# EAGLE schematic main (EAGLE 8.7.0)
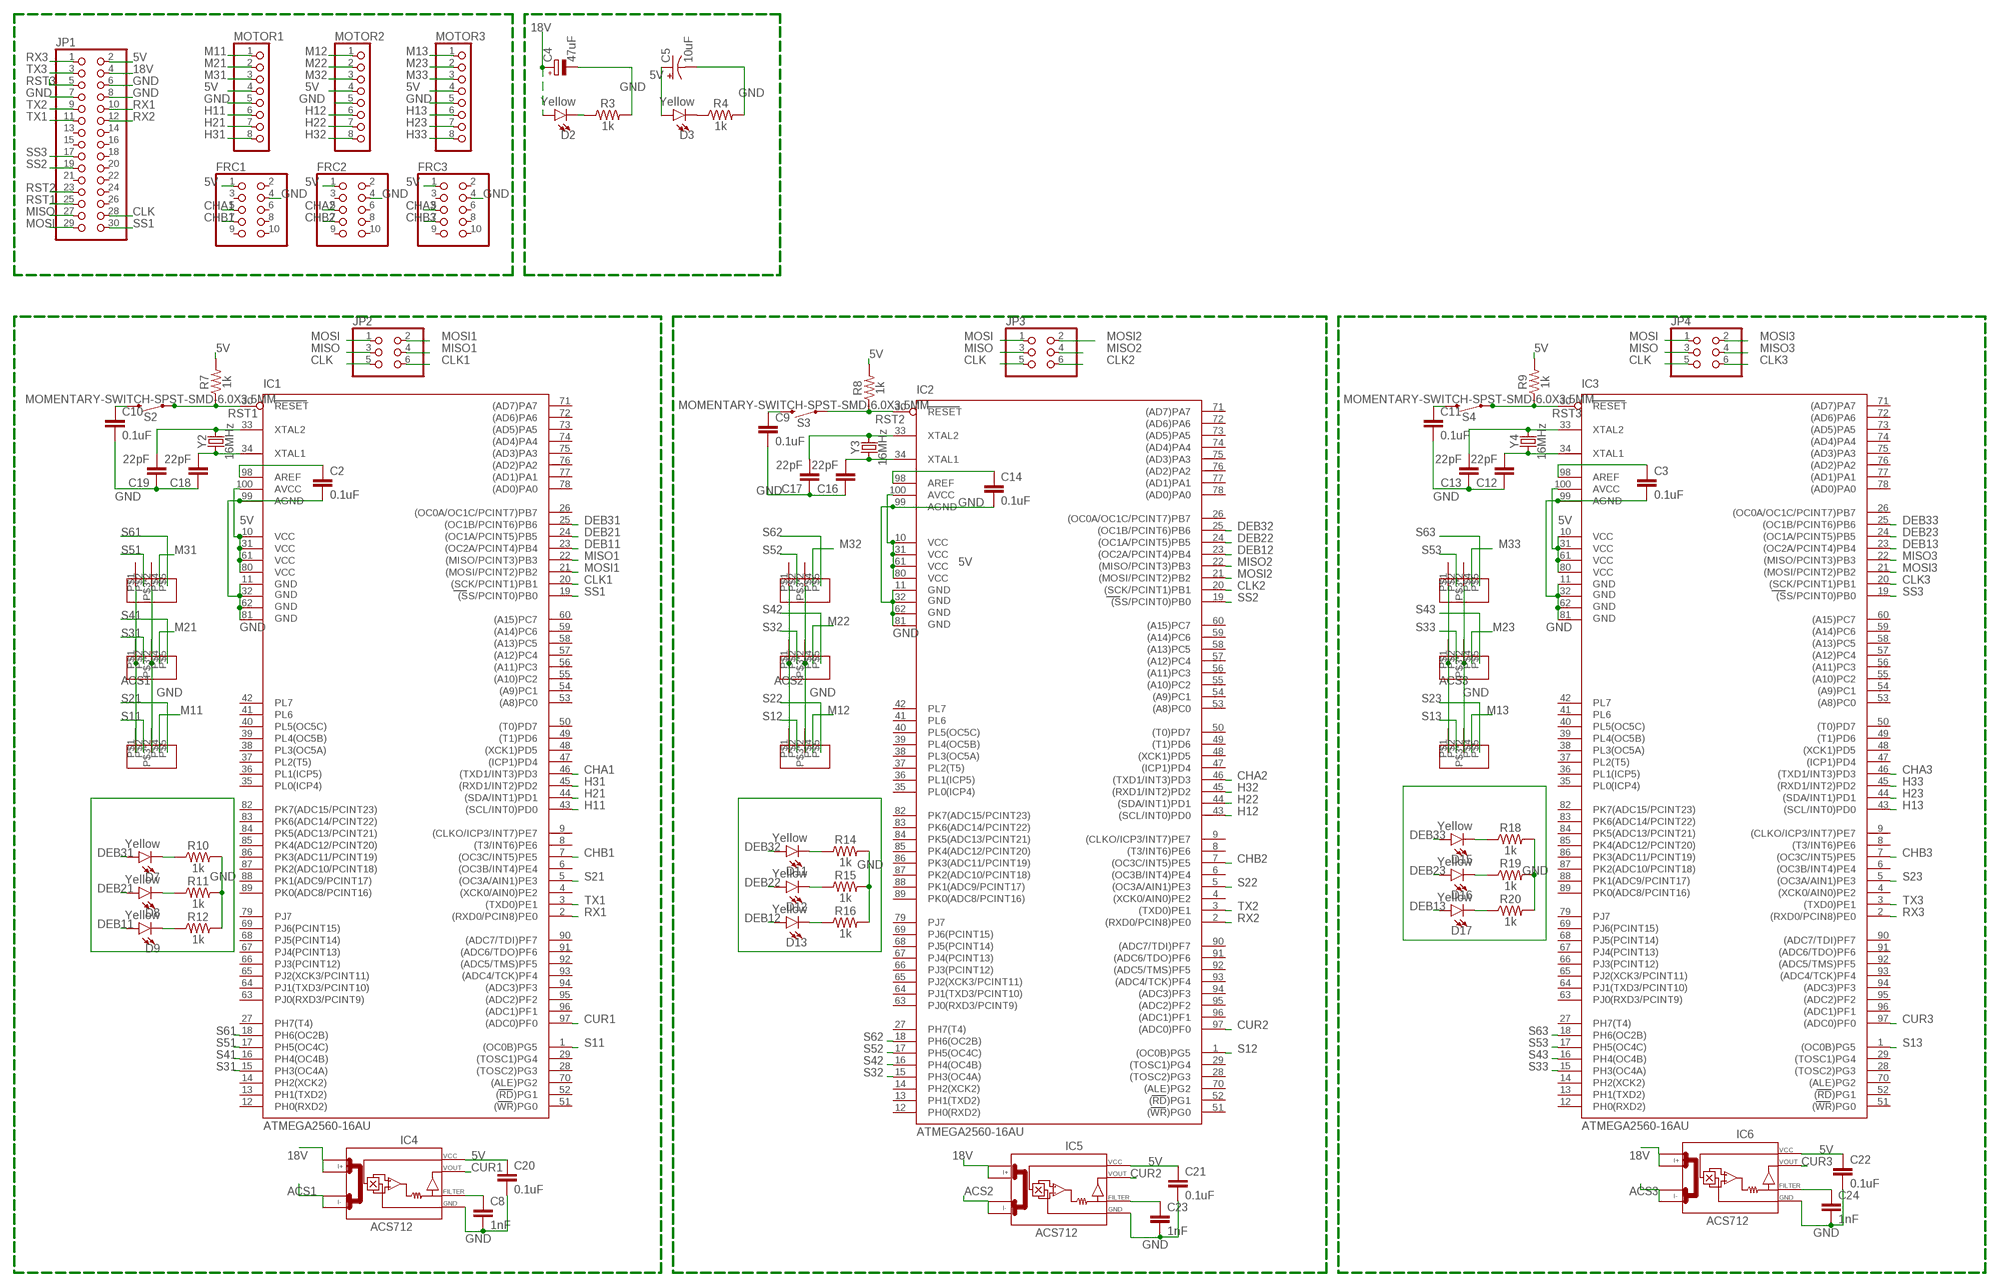
[diagram p0: schematic, sheet 1]

## Parts
C2  0.1uF  0.1UF-0603-25V-5%  [0603]
C3  0.1uF  0.1UF-0603-25V-5%  [0603]
C4  47uF  CPOL-EUTAP5-60  [TAP5-60]
C5  10uF  10UF-POLAR-0603-6.3V-20%(TANT)  [0603-POLAR]
C8  1nF  1.0NF/1000PF-0603-50V-10%  [0603]
C9  0.1uF  0.1UF-0603-25V-5%  [0603]
C10  0.1uF  0.1UF-0603-25V-5%  [0603]
C11  0.1uF  0.1UF-0603-25V-5%  [0603]
C12  22pF  22PF-0603-50V-5%  [0603]
C13  22pF  22PF-0603-50V-5%  [0603]
C14  0.1uF  0.1UF-0603-25V-5%  [0603]
C16  22pF  22PF-0603-50V-5%  [0603]
C17  22pF  22PF-0603-50V-5%  [0603]
C18  22pF  22PF-0603-50V-5%  [0603]
C19  22pF  22PF-0603-50V-5%  [0603]
C20  0.1uF  0.1UF-0603-25V-5%  [0603]
C21  0.1uF  0.1UF-0603-25V-5%  [0603]
C22  0.1uF  0.1UF-0603-25V-5%  [0603]
C23  1nF  1.0NF/1000PF-0603-50V-10%  [0603]
C24  1nF  1.0NF/1000PF-0603-50V-10%  [0603]
D2  Yellow  LED-YELLOW0603  [LED-0603]
D3  Yellow  LED-YELLOW0603  [LED-0603]
D7  Yellow  LED-YELLOW0603  [LED-0603]
D8  Yellow  LED-YELLOW0603  [LED-0603]
D9  Yellow  LED-YELLOW0603  [LED-0603]
D11  Yellow  LED-YELLOW0603  [LED-0603]
D12  Yellow  LED-YELLOW0603  [LED-0603]
D13  Yellow  LED-YELLOW0603  [LED-0603]
D15  Yellow  LED-YELLOW0603  [LED-0603]
D16  Yellow  LED-YELLOW0603  [LED-0603]
D17  Yellow  LED-YELLOW0603  [LED-0603]
FRC1  PINHD-2X5  [2X05]
FRC2  PINHD-2X5  [2X05]
FRC3  PINHD-2X5  [2X05]
IC1  ATMEGA2560-16AU  [TQFP100]
IC2  ATMEGA2560-16AU  [TQFP100]
IC3  ATMEGA2560-16AU  [TQFP100]
IC4  ACS712  [SO08]
IC5  ACS712  [SO08]
IC6  ACS712  [SO08]
JP1  PINHD-2X15/90  [2X15/90]
JP2  PINHD-2X3  [2X03]
JP3  PINHD-2X3  [2X03]
JP4  PINHD-2X3  [2X03]
MIC1  UC2950  [UC2950]
MIC2  UC2950  [UC2950]
MIC3  UC2950  [UC2950]
MIC4  UC2950  [UC2950]
MIC5  UC2950  [UC2950]
MIC6  UC2950  [UC2950]
MIC7  UC2950  [UC2950]
MIC8  UC2950  [UC2950]
MIC9  UC2950  [UC2950]
MOTOR1  PINHD-1X8  [1X08]
MOTOR2  PINHD-1X8  [1X08]
MOTOR3  PINHD-1X8  [1X08]
R3  1k  1KOHM-0603-1/10W-1%  [0603]
R4  1k  1KOHM-0603-1/10W-1%  [0603]
R7  1k  1KOHM-0603-1/10W-1%  [0603]
R8  1k  1KOHM-0603-1/10W-1%  [0603]
R9  1k  1KOHM-0603-1/10W-1%  [0603]
R10  1k  1KOHM-0603-1/10W-1%  [0603]
R11  1k  1KOHM-0603-1/10W-1%  [0603]
R12  1k  1KOHM-0603-1/10W-1%  [0603]
R14  1k  1KOHM-0603-1/10W-1%  [0603]
R15  1k  1KOHM-0603-1/10W-1%  [0603]
R16  1k  1KOHM-0603-1/10W-1%  [0603]
R18  1k  1KOHM-0603-1/10W-1%  [0603]
R19  1k  1KOHM-0603-1/10W-1%  [0603]
R20  1k  1KOHM-0603-1/10W-1%  [0603]
S2  MOMENTARY-SWITCH-SPST-SMD-6.0X3.5MM  [TACTILE_SWITCH_SMD_6.0X3.5MM]
S3  MOMENTARY-SWITCH-SPST-SMD-6.0X3.5MM  [TACTILE_SWITCH_SMD_6.0X3.5MM]
S4  MOMENTARY-SWITCH-SPST-SMD-6.0X3.5MM  [TACTILE_SWITCH_SMD_6.0X3.5MM]
Y2  16MHz  CRYSTAL-16MHZSMD-5X3.2  [CRYSTAL-SMD-5X3.2-4PAD]
Y3  16MHz  CRYSTAL-16MHZSMD-5X3.2  [CRYSTAL-SMD-5X3.2-4PAD]
Y4  16MHz  CRYSTAL-16MHZSMD-5X3.2  [CRYSTAL-SMD-5X3.2-4PAD]

## Nets
5V: C5.+ C20.1 C21.1 C22.1 D3.A FRC1.1 FRC2.1 FRC3.1 IC1.10(VCC) IC1.31(VCC1) IC1.61(VCC2) IC1.80(VCC3) IC1.100(AVCC) IC2.10(VCC) IC2.31(VCC1) IC2.61(VCC2) IC2.80(VCC3) IC2.100(AVCC) IC3.10(VCC) IC3.31(VCC1) IC3.61(VCC2) IC3.80(VCC3) IC3.100(AVCC) IC4.8(VCC) IC5.8(VCC) IC6.8(VCC) JP1.2 MOTOR1.4 MOTOR2.4 MOTOR3.4 R7.2 R8.2 R9.2
18V: C4.+ D2.A IC4.1(I+_0) IC5.1(I+_0) IC6.1(I+_0) JP1.4
ACS1: IC4.3(I-_0) MIC1.P$1 MIC2.P$1 MIC3.P$1
ACS2: IC5.3(I-_0) MIC4.P$1 MIC5.P$1 MIC6.P$1
ACS3: IC6.3(I-_0) MIC7.P$1 MIC8.P$1 MIC9.P$1
CHA1: FRC1.5 IC1.46((TXD1/INT3)PD3)
CHA2: FRC2.5 IC2.46((TXD1/INT3)PD3)
CHA3: FRC3.5 IC3.46((TXD1/INT3)PD3)
CHB1: FRC1.7 IC1.7((OC3C/INT5)PE5)
CHB2: FRC2.7 IC2.7((OC3C/INT5)PE5)
CHB3: FRC3.7 IC3.7((OC3C/INT5)PE5)
CLK: JP1.28 JP2.5 JP3.5 JP4.5
CLK1: IC1.20((SCK/PCINT1)PB1) JP2.6
CLK2: IC2.20((SCK/PCINT1)PB1) JP3.6
CLK3: IC3.20((SCK/PCINT1)PB1) JP4.6
CUR1: IC1.97((ADC0)PF0) IC4.7(VOUT)
CUR2: IC2.97((ADC0)PF0) IC5.7(VOUT)
CUR3: IC3.97((ADC0)PF0) IC6.7(VOUT)
DEB11: D9.A IC1.23((OC2A/PCINT4)PB4)
DEB12: D13.A IC2.23((OC2A/PCINT4)PB4)
DEB13: D17.A IC3.23((OC2A/PCINT4)PB4)
DEB21: D8.A IC1.24((OC1A/PCINT5)PB5)
DEB22: D12.A IC2.24((OC1A/PCINT5)PB5)
DEB23: D16.A IC3.24((OC1A/PCINT5)PB5)
DEB31: D7.A IC1.25((OC1B/PCINT6)PB6)
DEB32: D11.A IC2.25((OC1B/PCINT6)PB6)
DEB33: D15.A IC3.25((OC1B/PCINT6)PB6)
GND: C2.2 C3.2 C4.- C5.- C8.2 C9.2 C10.2 C11.2 C12.1 C13.1 C14.2 C16.1 C17.1 C18.1 C19.1 C20.2 C21.2 C22.2 C23.2 C24.2 FRC1.4 FRC2.4 FRC3.4 IC1.11(GND) IC1.32(GND1) IC1.62(GND2) IC1.81(GND3) IC1.99(AGND) IC2.11(GND) IC2.32(GND1) IC2.62(GND2) IC2.81(GND3) IC2.99(AGND) IC3.11(GND) IC3.32(GND1) IC3.62(GND2) IC3.81(GND3) IC3.99(AGND) IC4.5(GND) IC5.5(GND) IC6.5(GND) JP1.6 JP1.7 JP1.8 MIC1.P$3 MIC1.P$6 MIC2.P$3 MIC2.P$6 MIC3.P$3 MIC3.P$6 MIC4.P$3 MIC4.P$6 MIC5.P$3 MIC5.P$6 MIC6.P$3 MIC6.P$6 MIC7.P$3 MIC7.P$6 MIC8.P$3 MIC8.P$6 MIC9.P$3 MIC9.P$6 MOTOR1.5 MOTOR2.5 MOTOR3.5 R3.2 R4.2 R10.2 R11.2 R12.2 R14.2 R15.2 R16.2 R18.2 R19.2 R20.2
H11: IC1.43((SCL/INT0)PD0) MOTOR1.6
H12: IC2.43((SCL/INT0)PD0) MOTOR2.6
H13: IC3.43((SCL/INT0)PD0) MOTOR3.6
H21: IC1.44((SDA/INT1)PD1) MOTOR1.7
H22: IC2.44((SDA/INT1)PD1) MOTOR2.7
H23: IC3.44((SDA/INT1)PD1) MOTOR3.7
H31: IC1.45((RXD1/INT2)PD2) MOTOR1.8
H32: IC2.45((RXD1/INT2)PD2) MOTOR2.8
H33: IC3.45((RXD1/INT2)PD2) MOTOR3.8
M11: MIC3.P$4 MOTOR1.1
M12: MIC6.P$4 MOTOR2.1
M13: MIC7.P$4 MOTOR3.1
M21: MIC2.P$4 MOTOR1.2
M22: MIC5.P$4 MOTOR2.2
M23: MIC8.P$4 MOTOR3.2
M31: MIC1.P$4 MOTOR1.3
M32: MIC4.P$4 MOTOR2.3
M33: MIC9.P$4 MOTOR3.3
MISO: JP1.27 JP2.3 JP3.3 JP4.3
MISO1: IC1.22((MISO/PCINT3)PB3) JP2.4
MISO2: IC2.22((MISO/PCINT3)PB3) JP3.4
MISO3: IC3.22((MISO/PCINT3)PB3) JP4.4
MOSI: JP1.29 JP2.1 JP3.1 JP4.1
MOSI1: IC1.21((MOSI/PCINT2)PB2) JP2.2
MOSI2: IC2.21((MOSI/PCINT2)PB2) JP3.2
MOSI3: IC3.21((MOSI/PCINT2)PB2) JP4.2
N$9: D2.C R3.1
N$11: C2.1 IC1.98(AREF)
N$13: D3.C R4.1
N$22: C10.1 S2.2
N$24: C3.1 IC3.98(AREF)
N$25: C11.1 S4.2
N$26: C14.1 IC2.98(AREF)
N$28: C9.1 S3.2
N$29: C19.2 IC1.33(XTAL2) Y2.3
N$30: C17.2 IC2.33(XTAL2) Y3.3
N$31: C16.2 IC2.34(XTAL1) Y3.1
N$32: C18.2 IC1.34(XTAL1) Y2.1
N$33: C13.2 IC3.33(XTAL2) Y4.3
N$34: C12.2 IC3.34(XTAL1) Y4.1
N$41: C8.1 IC4.6(FILTER)
N$44: C23.1 IC5.6(FILTER)
N$47: C24.1 IC6.6(FILTER)
N$51: D7.C R10.1
N$52: D8.C R11.1
N$53: D9.C R12.1
N$56: D11.C R14.1
N$57: D12.C R15.1
N$58: D13.C R16.1
N$61: D15.C R18.1
N$62: D16.C R19.1
N$63: D17.C R20.1
RST1: IC1.30(RESET) JP1.25 R7.1 S2.1
RST2: IC2.30(RESET) JP1.23 R8.1 S3.1
RST3: IC3.30(RESET) JP1.5 R9.1 S4.1
RX1: IC1.2((RXD0/PCIN8)PE0) JP1.10
RX2: IC2.2((RXD0/PCIN8)PE0) JP1.12
RX3: IC3.2((RXD0/PCIN8)PE0) JP1.1
S11: IC1.1((OC0B)PG5) MIC3.P$2
S12: IC2.1((OC0B)PG5) MIC6.P$2
S13: IC3.1((OC0B)PG5) MIC7.P$2
S21: IC1.5((OC3A/AIN1)PE3) MIC3.P$5
S22: IC2.5((OC3A/AIN1)PE3) MIC6.P$5
S23: IC3.5((OC3A/AIN1)PE3) MIC7.P$5
S31: IC1.15(PH3(OC4A)) MIC2.P$2
S32: IC2.15(PH3(OC4A)) MIC5.P$2
S33: IC3.15(PH3(OC4A)) MIC8.P$2
S41: IC1.16(PH4(OC4B)) MIC2.P$5
S42: IC2.16(PH4(OC4B)) MIC5.P$5
S43: IC3.16(PH4(OC4B)) MIC8.P$5
S51: IC1.17(PH5(OC4C)) MIC1.P$2
S52: IC2.17(PH5(OC4C)) MIC4.P$2
S53: IC3.17(PH5(OC4C)) MIC9.P$2
S61: IC1.18(PH6(OC2B)) MIC1.P$5
S62: IC2.18(PH6(OC2B)) MIC4.P$5
S63: IC3.18(PH6(OC2B)) MIC9.P$5
SS1: IC1.19((SS/PCINT0)PB0) JP1.30
SS2: IC2.19((SS/PCINT0)PB0) JP1.19
SS3: IC3.19((SS/PCINT0)PB0) JP1.17
TX1: IC1.3((TXD0)PE1) JP1.11
TX2: IC2.3((TXD0)PE1) JP1.9
TX3: IC3.3((TXD0)PE1) JP1.3
Unconnected: FRC1.2 FRC1.3 FRC1.6 FRC1.8 FRC1.9 FRC1.10 FRC2.2 FRC2.3 FRC2.6 FRC2.8 FRC2.9 FRC2.10 FRC3.2 FRC3.3 FRC3.6 FRC3.8 FRC3.9 FRC3.10 IC1.4((XCK0/AIN0)PE2) IC1.6((OC3B/INT4)PE4) IC1.8((T3/INT6)PE6) IC1.9((CLKO/ICP3/INT7)PE7) IC1.12(PH0(RXD2)) IC1.13(PH1(TXD2)) IC1.14(PH2(XCK2)) IC1.26((OC0A/OC1C/PCINT7)PB7) IC1.27(PH7(T4)) IC1.28((TOSC2)PG3) IC1.29((TOSC1)PG4) IC1.35(PL0(ICP4)) IC1.36(PL1(ICP5)) IC1.37(PL2(T5)) IC1.38(PL3(OC5A)) IC1.39(PL4(OC5B)) IC1.40(PL5(OC5C)) IC1.41(PL6) IC1.42(PL7) IC1.47((ICP1)PD4) IC1.48((XCK1)PD5) IC1.49((T1)PD6) IC1.50((T0)PD7) IC1.51((WR)PG0) IC1.52((RD)PG1) IC1.53((A8)PC0) IC1.54((A9)PC1) IC1.55((A10)PC2) IC1.56((A11)PC3) IC1.57((A12)PC4) IC1.58((A13)PC5) IC1.59((A14)PC6) IC1.60((A15)PC7) IC1.63(PJ0(RXD3/PCINT9)) IC1.64(PJ1(TXD3/PCINT10)) IC1.65(PJ2(XCK3/PCINT11)) IC1.66(PJ3(PCINT12)) IC1.67(PJ4(PCINT13)) IC1.68(PJ5(PCINT14)) IC1.69(PJ6(PCINT15)) IC1.70((ALE)PG2) IC1.71((AD7)PA7) IC1.72((AD6)PA6) IC1.73((AD5)PA5) IC1.74((AD4)PA4) IC1.75((AD3)PA3) IC1.76((AD2)PA2) IC1.77((AD1)PA1) IC1.78((AD0)PA0) IC1.79(PJ7) IC1.82(PK7(ADC15/PCINT23)) IC1.83(PK6(ADC14/PCINT22)) IC1.84(PK5(ADC13/PCINT21)) IC1.85(PK4(ADC12/PCINT20)) IC1.86(PK3(ADC11/PCINT19)) IC1.87(PK2(ADC10/PCINT18)) IC1.88(PK1(ADC9/PCINT17)) IC1.89(PK0(ADC8/PCINT16)) IC1.90((ADC7/TDI)PF7) IC1.91((ADC6/TDO)PF6) IC1.92((ADC5/TMS)PF5) IC1.93((ADC4/TCK)PF4) IC1.94((ADC3)PF3) IC1.95((ADC2)PF2) IC1.96((ADC1)PF1) IC2.4((XCK0/AIN0)PE2) IC2.6((OC3B/INT4)PE4) IC2.8((T3/INT6)PE6) IC2.9((CLKO/ICP3/INT7)PE7) IC2.12(PH0(RXD2)) IC2.13(PH1(TXD2)) IC2.14(PH2(XCK2)) IC2.26((OC0A/OC1C/PCINT7)PB7) IC2.27(PH7(T4)) IC2.28((TOSC2)PG3) IC2.29((TOSC1)PG4) IC2.35(PL0(ICP4)) IC2.36(PL1(ICP5)) IC2.37(PL2(T5)) IC2.38(PL3(OC5A)) IC2.39(PL4(OC5B)) IC2.40(PL5(OC5C)) IC2.41(PL6) IC2.42(PL7) IC2.47((ICP1)PD4) IC2.48((XCK1)PD5) IC2.49((T1)PD6) IC2.50((T0)PD7) IC2.51((WR)PG0) IC2.52((RD)PG1) IC2.53((A8)PC0) IC2.54((A9)PC1) IC2.55((A10)PC2) IC2.56((A11)PC3) IC2.57((A12)PC4) IC2.58((A13)PC5) IC2.59((A14)PC6) IC2.60((A15)PC7) IC2.63(PJ0(RXD3/PCINT9)) IC2.64(PJ1(TXD3/PCINT10)) IC2.65(PJ2(XCK3/PCINT11)) IC2.66(PJ3(PCINT12)) IC2.67(PJ4(PCINT13)) IC2.68(PJ5(PCINT14)) IC2.69(PJ6(PCINT15)) IC2.70((ALE)PG2) IC2.71((AD7)PA7) IC2.72((AD6)PA6) IC2.73((AD5)PA5) IC2.74((AD4)PA4) IC2.75((AD3)PA3) IC2.76((AD2)PA2) IC2.77((AD1)PA1) IC2.78((AD0)PA0) IC2.79(PJ7) IC2.82(PK7(ADC15/PCINT23)) IC2.83(PK6(ADC14/PCINT22)) IC2.84(PK5(ADC13/PCINT21)) IC2.85(PK4(ADC12/PCINT20)) IC2.86(PK3(ADC11/PCINT19)) IC2.87(PK2(ADC10/PCINT18)) IC2.88(PK1(ADC9/PCINT17)) IC2.89(PK0(ADC8/PCINT16)) IC2.90((ADC7/TDI)PF7) IC2.91((ADC6/TDO)PF6) IC2.92((ADC5/TMS)PF5) IC2.93((ADC4/TCK)PF4) IC2.94((ADC3)PF3) IC2.95((ADC2)PF2) IC2.96((ADC1)PF1) IC3.4((XCK0/AIN0)PE2) IC3.6((OC3B/INT4)PE4) IC3.8((T3/INT6)PE6) IC3.9((CLKO/ICP3/INT7)PE7) IC3.12(PH0(RXD2)) IC3.13(PH1(TXD2)) IC3.14(PH2(XCK2)) IC3.26((OC0A/OC1C/PCINT7)PB7) IC3.27(PH7(T4)) IC3.28((TOSC2)PG3) IC3.29((TOSC1)PG4) IC3.35(PL0(ICP4)) IC3.36(PL1(ICP5)) IC3.37(PL2(T5)) IC3.38(PL3(OC5A)) IC3.39(PL4(OC5B)) IC3.40(PL5(OC5C)) IC3.41(PL6) IC3.42(PL7) IC3.47((ICP1)PD4) IC3.48((XCK1)PD5) IC3.49((T1)PD6) IC3.50((T0)PD7) IC3.51((WR)PG0) IC3.52((RD)PG1) IC3.53((A8)PC0) IC3.54((A9)PC1) IC3.55((A10)PC2) IC3.56((A11)PC3) IC3.57((A12)PC4) IC3.58((A13)PC5) IC3.59((A14)PC6) IC3.60((A15)PC7) IC3.63(PJ0(RXD3/PCINT9)) IC3.64(PJ1(TXD3/PCINT10)) IC3.65(PJ2(XCK3/PCINT11)) IC3.66(PJ3(PCINT12)) IC3.67(PJ4(PCINT13)) IC3.68(PJ5(PCINT14)) IC3.69(PJ6(PCINT15)) IC3.70((ALE)PG2) IC3.71((AD7)PA7) IC3.72((AD6)PA6) IC3.73((AD5)PA5) IC3.74((AD4)PA4) IC3.75((AD3)PA3) IC3.76((AD2)PA2) IC3.77((AD1)PA1) IC3.78((AD0)PA0) IC3.79(PJ7) IC3.82(PK7(ADC15/PCINT23)) IC3.83(PK6(ADC14/PCINT22)) IC3.84(PK5(ADC13/PCINT21)) IC3.85(PK4(ADC12/PCINT20)) IC3.86(PK3(ADC11/PCINT19)) IC3.87(PK2(ADC10/PCINT18)) IC3.88(PK1(ADC9/PCINT17)) IC3.89(PK0(ADC8/PCINT16)) IC3.90((ADC7/TDI)PF7) IC3.91((ADC6/TDO)PF6) IC3.92((ADC5/TMS)PF5) IC3.93((ADC4/TCK)PF4) IC3.94((ADC3)PF3) IC3.95((ADC2)PF2) IC3.96((ADC1)PF1) IC4.2(I+_1) IC4.4(I-_1) IC5.2(I+_1) IC5.4(I-_1) IC6.2(I+_1) IC6.4(I-_1) JP1.13 JP1.14 JP1.15 JP1.16 JP1.18 JP1.20 JP1.21 JP1.22 JP1.24 JP1.26

## Library data of the parts
C2 C3 C9-C11 C14 C20-C22 = SparkFun-Capacitors:0.1UF: 0.1µF ceramic capacitors A capacitor is a passive two-terminal electrical component used to store electrical energy temporarily in an electric field.; PROD_ID: CAP-08604
C4 = rcl:CPOL-EU: POLARIZED CAPACITOR, European symbol; SPICEPREFIX: C
C5 = SparkFun-Capacitors:10UF-POLAR: 10.0µF polarized capacitors A capacitor is a passive two-terminal electrical component used to store electrical energy temporarily in an electric field.; PROD_ID: CAP-13210
C8 C23 C24 = SparkFun-Capacitors:1.0NF/1000PF: 1nF/1,000pF ceramic capacitors A capacitor is a passive two-terminal electrical component used to store electrical energy temporarily in an electric field.; PROD_ID: CAP-07886
C12 C13 C16-C19 = SparkFun-Capacitors:22PF: 22pF ceramic capacitors A capacitor is a passive two-terminal electrical component used to store electrical energy temporarily in an electric field.; PROD_ID: CAP-07876
D2 D3 D7-D9 D11-D13 D15-D17 = SparkFun-LED:LED-YELLOW: Yellow SMD LED Used in manufacturing several products at SparkFun. Packages: 0603 - SMD 0603 package[Product Link] <http://www.kingbrightusa.com/product.asp?catalog_name=LED&product_id=APT1608SYCK> 0603 -SMART - SMART SMD 0603 package (more efficient/more expensive) [Product Link] <http://www.osram-os.com/osram_os/en/products/product-catalog/led-light-emitting-diodes/smartled-0603/ly-l29k/index.jsp> LilyPad - SMD1206 package[Product Datasheet] <https://www.sparkfun.com/datasheets/DevTools/LilyPad/Q150YUS4.pdf> SparkFun Products: Blynk Board <https://www.sparkfun.com/products/13794> IOIO-OTG <https://www.sparkfun.com/products/13613> XBee Explorer Serial <https://www.sparkfun.com/products/13225>; PROD_ID: DIO-09003
FRC1-FRC3 = pinhead:PINHD-2X5: PIN HEADER
IC1-IC3 = atmel-2005:ATMEGA*: MICROCONTROLLER 64/128/256 Kbytes FLASH 4 Kbytes EEPROM 8 Kbytes SRAM 86 General Purpose I/O pins 12-channels16-bit PWM 4 x Serial USARTs 16-channels 10-bit A/D
IC4-IC6 = ACS712:ACS712
JP1 = pinhead:PINHD-2X15: PIN HEADER
JP2-JP4 = pinhead:PINHD-2X3: PIN HEADER
MIC1-MIC9 = uc2950:UC2950: UC2950T Motor Driver IC
MOTOR1-MOTOR3 = pinhead:PINHD-1X8: PIN HEADER
R3 R4 R7-R12 R14-R16 R18-R20 = SparkFun-Resistors:1KOHM: 1kΩ resistor A resistor is a passive two-terminal electrical component that implements electrical resistance as a circuit element. Resistors act to reduce current flow, and, at the same time, act to lower voltage levels within circuits. - Wikipedia; PROD_ID: RES-07856
S2-S4 = SparkFun-Switches:MOMENTARY-SWITCH-SPST: Momentary Switch (Pushbutton) - SPST Normally-open (NO) SPST momentary switches (buttons, pushbuttons). Variants PTH-12MM - 12mm square, through-hole Momentary Pushbutton Switch - 12mm Square <https://www.sparkfun.com/products/9190> (COM-09190) PTH-6.0MM, PTH-6.0MM-KIT - 6.0mm square, through-hole Mini Pushbutton Switch <https://www.sparkfun.com/products/97> (COM-00097) KIT package intended for soldering kit's - only one side of pads' copper is exposed. PTH-RIGHT-ANGLE-KIT - Right-angle, through-hole Right Angle Tactile Button <https://www.sparkfun.com/products/10791> - Used on SparkFun BigTime Watch Kit <https://www.sparkfun.com/products/11734> SMD-12MM - 12mm square, surface-mount Tactile Button - SMD (12mm) <https://www.sparkfun.com/products/12993> (COM-12993) Used on SparkFun PicoBoard <https://www.sparkfun.com/products/11888> SMD-4.5MM - 4.5mm Square Trackball Switch Used on SparkFun Blackberry Trackballer Breakout <https://www.sparkfun.com/products/13169> SMD-4.6MMX2.8MM - 4.60mm x 2.80mm, surface mount Used on SparkFun SAMD21 Mini Breakout <https://www.sparkfun.com/products/13664> SMD-5.2MM, SMD-5.2-REDUNDANT - 5.2mm square, surface-mount Mini Pushbutton Switch - SMD <https://www.sparkfun.com/products/8720> (COM-08720) Used on Arduino Pro Mini <https://www.sparkfun.com/products/11114> REDUNDANT package connects both switch circuits together SMD-6.0X3.5MM - 6.0 x 3.5mm, surface mount Momentary Reset Switch SMD <https://www.sparkfun.com/products/8229> (COM-08229) SMD-6.2MM-TALL - 6.2mm square, surface mount Tactile Button - SMD (6mm) <https://www.sparkfun.com/products/12992> Used on SparkFun Digital Sandbox <https://www.sparkfun.com/products/12651> SMD-RIGHT-ANGLE - Right-angle, surface mount Used on SparkFun Block for Intel® Edison - Arduino <https://www.sparkfun.com/products/13036>; PROD_ID: SWCH-00815; SF_SKU: COM-08229
Y2-Y4 = SparkFun-Clocks:CRYSTAL-16MHZ: 16MHz Crystal Digikey Example <http://www.digikey.com/product-search/en?keywords=535-9122-1-ND> Frequency: 16MHz Frequency Stability: ±50ppm Frequency Tolerance: ±20ppm Load Capacitance: 18pF SparkFun Products: Pro Micro -5V/16MHz <https://www.sparkfun.com/products/12640> SparkFun Serial Enabled LCD Kit <https://www.sparkfun.com/products/10097>; PROD_ID: XTAL-08218; SF_ID: COM-00094